# Altium schematic sheet PyNab_Audio.SchDoc: PyNab - Audio
size A4; CompanyName: Enero; DrawnBy: Enero; Engineer: Hugo Balette-pape; Organization: ENERO; Address1: 7, rue ambroise thomas; Address2: 75009; Address3: Paris; Address4: France; Revision: 2.0; SheetNumber: 3; SheetTotal: 4
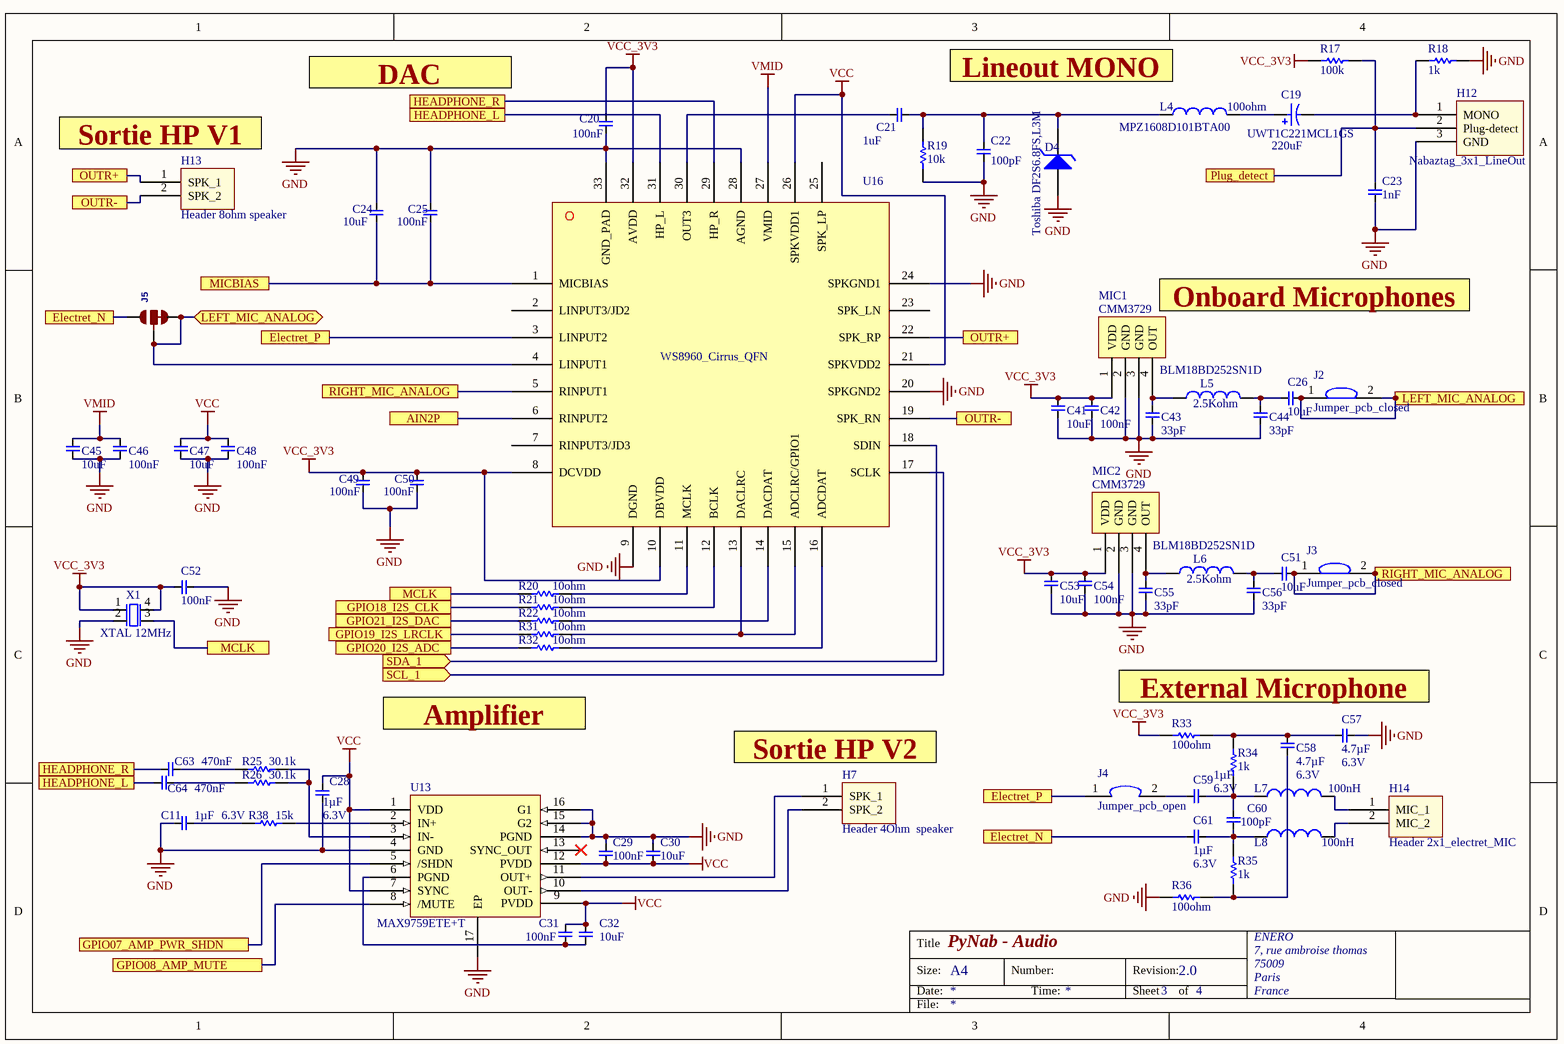
[diagram p0: PyNab_Audio.SchDoc]

## Parts
C11  Voltage: 6.3V  [CAP0603]  (hidden comment: 1µF)
C19  UWT1C221MCL1GS  value 220uF  [CAPAE7066X80M]
C20  100nF  [CAP0603]
C21  1uF  [CAP0603]
C22  100pF  [CAP0603]
C23  1nF  [CAP0603]
C24  10uF  [CAP0603]
C25  100nF  [CAP0603]
C26  10uF  [CAP0603]
C28  Voltage: 6.3V  [CAP0603]  (hidden comment: 1µF)
C29  100nF  [CAP0603]
C30  10uF  [CAP0603]
C31  100nF  [CAP0603]
C32  10uF  [CAP0603]
C41  10uF  [CAP0603]
C42  100nF  [CAP0603]
C43  33pF  [CAP0603]
C44  33pF  [CAP0603]
C45  10uF  [CAP0603]
C46  100nF  [CAP0603]
C47  10uF  [CAP0603]
C48  100nF  [CAP0603]
C49  100nF  [CAP0603]
C50  100nF  [CAP0603]
C51  10uF  [CAP0603]
C52  100nF  [CAP0603]
C53  10uF  [CAP0603]
C54  100nF  [CAP0603]
C55  33pF  [CAP0603]
C56  33pF  [CAP0603]
C57  Voltage: 6.3V  [CAP0603]  (hidden comment: 4.7µF)
C58  Voltage: 6.3V  [CAP0603]  (hidden comment: 4.7µF)
C59  Voltage: 6.3V  [CAP0603]  (hidden comment: 1µF)
C60  100pF  [CAP0603]
C61  Voltage: 6.3V  [CAP0603]  (hidden comment: 1µF)
C63  470nF  [CAP0603]
C64  470nF  [CAP0603]
D4  Toshiba DF2S6.8FS,L3M  [Diode SOD-923 DF2S6.8FS]
H7  Header 4Ohm  speaker  [HRD2x1_SPEAKER_Nabaztag]
H12  Nabaztag_3x1_LineOut  [Nabaztag_LineOut]
H13  Header 8ohm speaker  [HRD2x1_SPEAKER_Nabaztag]
H14  Header 2x1_electret_MIC  [HRD2x1_MIC_Nabaztag]
J2  Jumper_pcb_closed  [Jumper_pcb_closed 2]
J3  Jumper_pcb_closed  [Jumper_pcb_closed 2]
J4  Jumper_pcb_open  [Jumper_pcb open 2]
J5  Normally closed trace jumper (1 of 2 connections)This jumper has a trace between two pads so it's normally closed (NC). The other connection is normally open (NO). Use a razor knife to open the connection. For best results follow the IPC guidelines for cutting traces:Reapply solder to reclose the connection, or to close the NO connection.  [Jumper_pcb_3poles]  (value not drawn)
L4  MPZ1608D101BTA00  value 100ohm  [IND0603]
L5  BLM18BD252SN1D  value 2.5Kohm  [IND0603]
L6  BLM18BD252SN1D  value 2.5Kohm  [IND0603]
L7  value 100nH  [IND0603]  (hidden comment: MLZ1608DR10DT)
L8  value 100nH  [IND0603]  (hidden comment: MLZ1608DR10DT)
MIC1  CMM3729  [DFN246P295X110-4N]
MIC2  CMM3729  [DFN246P295X110-4N]
R17  100k  [RES0603]
R18  1k  [RES0603]
R19  10k  [RES0603]
R20  10ohm  [RES0603]
R21  10ohm  [RES0603]
R22  10ohm  [RES0603]
R25  30.1k  [RES0603]
R26  30.1k  [RES0603]
R31  10ohm  [RES0603]
R32  10ohm  [RES0603]
R33  100ohm  [RES0603]
R34  1k  [RES0603]
R35  1k  [RES0603]
R36  100ohm  [RES0603]
R38  15k  [RES0603]
U13  MAX9759ETE+T  [MAX9759ETE+T]
U16  WS8960_Cirrus_QFN  [QFN50P500X500X100_HS-33N]
X1  XTAL 12MHz  [XTAL_2025_4Pin ECS-2520S33-120-FN-TR]

## Ports
AIN2P, Electret_N, Electret_P, GPIO07_AMP_PWR_SHDN, GPIO08_AMP_MUTE, GPIO18_I2S_CLK, GPIO19_I2S_LRCLK, GPIO20_I2S_ADC, GPIO21_I2S_DAC, HEADPHONE_L, HEADPHONE_R, LEFT_MIC_ANALOG, LEFT_MIC_ANALOG (bidir), MCLK, MICBIAS, OUTR+, OUTR-, Plug_detect, RIGHT_MIC_ANALOG, SCL_1 (in), SDA_1 (in)

## Nets
GND: C11.2 C20.1 C22.1 C23.1 C24.2 C25.2 C28.2 C29.2 C30.1 C41.2 C42.1 C43.1 C44.1 C45.2 C46.1 C47.2 C48.1 C49.1 C50.1 C52.1 C53.2 C54.1 C55.1 C56.1 C57.2 D4.2(A) H12.3(GND) MIC1.2(GND) MIC1.3(GND) MIC2.2(GND) MIC2.3(GND) R18.1 R19.1 R36.2 U13.4(GND) U13.14(PGND) U13.15(G2) U13.16(G1) U13.17(EP) U16.9(DGND) U16.20(SPKGND2) U16.24(SPKGND1) U16.28(AGND) U16.33(GND_PAD) X1.2(GND)
VCC: C28.1 C29.1 C30.2 C31.2 C32.1 C47.1 C48.2 U13.1(VDD) U13.7(SYNC) U13.9(PVDD) U13.12(PVDD) U16.21(SPKVDD2) U16.26(SPKVDD1)
VCC_3V3: C20.2 C41.1 C42.2 C49.2 C50.2 C52.2 C53.1 C54.2 MIC1.1(VDD) MIC2.1(VDD) R17.2 R33.2 U16.8(DCVDD) U16.10(DBVDD) U16.32(AVDD) X1.1(EN) X1.4(VDD)
VMID: C45.1 C46.2 U16.27(VMID)
AIN2P: U16.6(RINPUT2) ; port AIN2P
Electret_N: C61.2 J5.1 ; port Electret_N
Electret_P: J4.1 U16.3(LINPUT2) ; port Electret_P
GPIO07_AMP_PWR_SHDN: U13.5(/SHDN) ; port GPIO07_AMP_PWR_SHDN
GPIO08_AMP_MUTE: U13.8(/MUTE) ; port GPIO08_AMP_MUTE
GPIO18_I2S_CLK: R21.2 ; port GPIO18_I2S_CLK
GPIO19_I2S_LRCLK: R31.2 ; port GPIO19_I2S_LRCLK
GPIO20_I2S_ADC: R32.2 ; port GPIO20_I2S_ADC
GPIO21_I2S_DAC: R22.2 ; port GPIO21_I2S_DAC
HEADPHONE_L: C64.2 U16.31(HP_L) ; port HEADPHONE_L
HEADPHONE_R: C63.2 U16.29(HP_R) ; port HEADPHONE_R
LEFT_MIC_ANALOG: C26.2 J2.1 J2.2 J5.2 J5.3 U16.4(LINPUT1) ; port LEFT_MIC_ANALOG
MCLK: R20.2 X1.3(OUT) ; port MCLK
MICBIAS: C24.1 C25.1 U16.1(MICBIAS) ; port MICBIAS
OUTR+: H13.1(SPK_1) U16.22(SPK_RP) ; port OUTR+
OUTR-: H13.2(SPK_2) U16.19(SPK_RN) ; port OUTR-
Plug_detect: C23.2 H12.2(Plug-detect) R17.1 ; port Plug_detect
RIGHT_MIC_ANALOG: C51.2 J3.1 J3.2 U16.5(RINPUT1) ; port RIGHT_MIC_ANALOG
SCL_1: U16.17(SCLK) ; port SCL_1
SDA_1: U16.18(SDIN) ; port SDA_1
NetC11_1: C11.1 R38.2
NetC19_1: C19.1(K) H12.1(MONO) R18.2
NetC19_2: C19.2(A) L4.1
NetC21_1: C21.1 U16.30(OUT3)
NetC21_2: C21.2 C22.2 D4.1(K) L4.2 R19.2
NetC26_1: C26.1 C44.2 L5.1
NetC31_1: C31.1 C32.2 U13.6(PGND)
NetC43_2: C43.2 L5.2 MIC1.4(OUT)
NetC51_1: C51.1 C56.2 L6.1
NetC55_2: C55.2 L6.2 MIC2.4(OUT)
NetC57_1: C57.1 C58.1 R33.1 R34.2
NetC58_2: C58.2 R35.1 R36.1
NetC59_1: C59.1 C60.1 L7.2 R34.1
NetC59_2: C59.2 J4.2
NetC60_2: C60.2 C61.1 L8.2 R35.2
NetC63_1: C63.1 R25.2
NetC64_1: C64.1 R26.2
NetH7_1: H7.1(SPK_1) U13.11(OUT+)
NetH7_2: H7.2(SPK_2) U13.10(OUT-)
NetH14_1: H14.1(MIC_1) L7.1
NetH14_2: H14.2(MIC_2) L8.1
NetR20_1: R20.1 U16.11(MCLK)
NetR21_1: R21.1 U16.12(BCLK)
NetR22_1: R22.1 U16.14(DACDAT)
NetR25_1: R25.1 R26.1 U13.3(IN-)
NetR31_1: R31.1 U16.13(DACLRC) U16.15(ADCLRC/GPIO1)
NetR32_1: R32.1 U16.16(ADCDAT)
NetR38_1: R38.1 U13.2(IN+)

Not connected (* = marked no-connect by the designer): U13 13(SYNC_OUT)*; U16 2(LINPUT3/JD2) 7(RINPUT3/JD3) 23(SPK_LN) 25(SPK_LP)

## Notes on the sheet
- DAC
- (near L4) Lineout MONO
- (near H13) Sortie HP V1
- (near MIC1) Onboard Microphones
- Amplifier
- External Microphone
- (near H7) Sortie HP V2
- Title
- Size:
- Date:
- A4
- Number:
- Time:
- Revision:
- Sheet
- of
- File:

## Library data of the parts
C11 C20-C26 C28-C32 C41-C59 C61 C63 C64 = Capacitor_np: Non-polarised capacitor
  C11 C28 C59 C61: Value: 1µF
  C20 C25 C29 C31 C42 C46 C48-C50 C52 C54: Value: 100nF
  C21: Value: 1uF
  C22: Value: 100pF
  C23: Value: 1nF
  C24 C26 C30 C32 C41 C45 C47 C51 C53: Value: 10uF
  C43 C44 C55 C56: Value: 33pF
  C57 C58: Value: 4.7µF
  C63 C64: Value: 470nF
C19 = Capacitor_pol: Polarised capacitor
C60 = Capacitor_np: Non-polarised capacitor; Voltage: 6.3V; Value: 100pF
D4 = Diode ESD DF2S6.8FS
H7 H13 = Header 2x1_speaker
J5 = JUMPER-SMT_3_1-NC_TRACE_SILK: GateName_1: G$1; SymbolName_1: SMT-JUMPER_3_1-NC_TRACE; DeviceName: _SILK; LibraryName: Sparkfun_jumper; DeviceSetName: JUMPER-SMT_3_1-NC_TRACE; Package: SMT-JUMPER_3_1-NC_TRACE_SILK
L4-L6 = Inductor1: Inductor 0603 blm18pg330sn
L7 L8 = Inductor1: Inductor 0603 MLZ1608DR10DT
R17-R22 R25 R26 R31-R36 R38 = Resistor1: Resistor
  R17: Value: 100k
  R18 R34 R35: Value: 1k
  R19: Value: 10k
  R20-R22 R31 R32: Value: 10ohm
  R25 R26: Value: 30.1k
  R33 R36: Value: 100ohm
  R38: Value: 15k
X1 = XTAL_2025_4pin